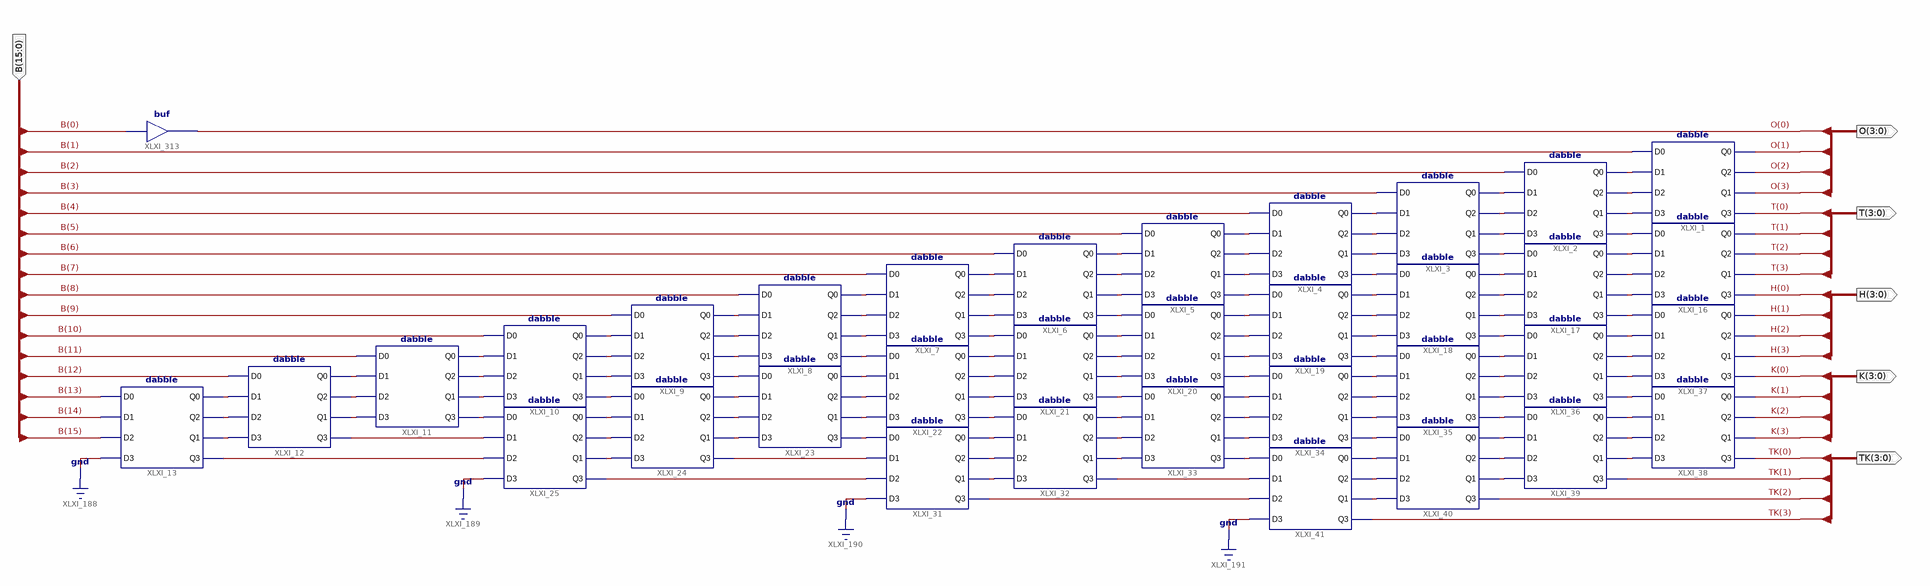
[diagram p0: schematic sheet 1]
// Xilinx ISE schematic dd16b.sch (spartan6) as structural Verilog: 35 symbols, 6 ports
module dd16b (
  input  [15:0] B,
  output [3:0] O,
  output [3:0] T,
  output [3:0] H,
  output [3:0] K,
  output [3:0] TK
);

  wire XLXN_4, XLXN_5, XLXN_6, XLXN_7, XLXN_8, XLXN_9, XLXN_10, XLXN_11, XLXN_12, XLXN_13, XLXN_14, XLXN_15,
       XLXN_16, XLXN_17, XLXN_18, XLXN_24, XLXN_25, XLXN_26, XLXN_27, XLXN_28, XLXN_29, XLXN_30, XLXN_31,
       XLXN_32, XLXN_33, XLXN_34, XLXN_35, XLXN_36, XLXN_37, XLXN_38, XLXN_39, XLXN_40, XLXN_41, XLXN_42,
       XLXN_43, XLXN_44, XLXN_45, XLXN_46, XLXN_47, XLXN_48, XLXN_49, XLXN_50, XLXN_51, XLXN_52, XLXN_53,
       XLXN_54, XLXN_55, XLXN_56, XLXN_57, XLXN_58, XLXN_59, XLXN_60, XLXN_61, XLXN_62, XLXN_63, XLXN_64,
       XLXN_65, XLXN_69, XLXN_70, XLXN_71, XLXN_72, XLXN_73, XLXN_74, XLXN_75, XLXN_76, XLXN_77, XLXN_78,
       XLXN_79, XLXN_80, XLXN_81, XLXN_82, XLXN_83, XLXN_84, XLXN_85, XLXN_86, XLXN_87, XLXN_88, XLXN_89,
       XLXN_90, XLXN_91, XLXN_92, XLXN_93, XLXN_94, XLXN_95, XLXN_96, XLXN_97, XLXN_98, XLXN_99, XLXN_103,
       XLXN_104, XLXN_105, XLXN_106, XLXN_107, XLXN_108, XLXN_109, XLXN_110, XLXN_111, XLXN_112, XLXN_113,
       XLXN_114, XLXN_115, XLXN_116, XLXN_117, XLXN_118, XLXN_119, XLXN_120, XLXN_121, XLXN_125, XLXN_126,
       XLXN_127, XLXN_128, XLXN_129, XLXN_130, XLXN_131, XLXN_135, XLXN_137, XLXN_139;

  dabble XLXI_1 (.D0(B[1]), .D1(XLXN_4), .D2(XLXN_5), .D3(XLXN_6), .Q0(O[1]), .Q1(O[3]), .Q2(O[2]), .Q3(T[0]));
  dabble XLXI_2 (
    .D0(B[2]), .D1(XLXN_38), .D2(XLXN_37), .D3(XLXN_36), .Q0(XLXN_4), .Q1(XLXN_6), .Q2(XLXN_5), .Q3(XLXN_7));
  dabble XLXI_3 (
    .D0(B[3]), .D1(XLXN_39), .D2(XLXN_40), .D3(XLXN_41), .Q0(XLXN_38), .Q1(XLXN_36), .Q2(XLXN_37),
    .Q3(XLXN_35));
  dabble XLXI_4 (
    .D0(B[4]), .D1(XLXN_48), .D2(XLXN_55), .D3(XLXN_56), .Q0(XLXN_39), .Q1(XLXN_41), .Q2(XLXN_40),
    .Q3(XLXN_42));
  dabble XLXI_5 (
    .D0(B[5]), .D1(XLXN_69), .D2(XLXN_70), .D3(XLXN_71), .Q0(XLXN_48), .Q1(XLXN_56), .Q2(XLXN_55),
    .Q3(XLXN_57));
  dabble XLXI_6 (
    .D0(B[6]), .D1(XLXN_81), .D2(XLXN_82), .D3(XLXN_83), .Q0(XLXN_69), .Q1(XLXN_71), .Q2(XLXN_70),
    .Q3(XLXN_72));
  dabble XLXI_7 (
    .D0(B[7]), .D1(XLXN_92), .D2(XLXN_93), .D3(XLXN_94), .Q0(XLXN_81), .Q1(XLXN_83), .Q2(XLXN_82),
    .Q3(XLXN_84));
  dabble XLXI_8 (
    .D0(B[8]), .D1(XLXN_103), .D2(XLXN_104), .D3(XLXN_105), .Q0(XLXN_92), .Q1(XLXN_94), .Q2(XLXN_93),
    .Q3(XLXN_95));
  dabble XLXI_9 (
    .D0(B[9]), .D1(XLXN_111), .D2(XLXN_112), .D3(XLXN_113), .Q0(XLXN_103), .Q1(XLXN_105), .Q2(XLXN_104),
    .Q3(XLXN_106));
  dabble XLXI_10 (
    .D0(B[10]), .D1(XLXN_118), .D2(XLXN_119), .D3(XLXN_120), .Q0(XLXN_111), .Q1(XLXN_113), .Q2(XLXN_112),
    .Q3(XLXN_114));
  dabble XLXI_11 (
    .D0(B[11]), .D1(XLXN_125), .D2(XLXN_126), .D3(XLXN_127), .Q0(XLXN_118), .Q1(XLXN_120), .Q2(XLXN_119),
    .Q3(XLXN_121));
  dabble XLXI_12 (
    .D0(B[12]), .D1(XLXN_129), .D2(XLXN_130), .D3(XLXN_131), .Q0(XLXN_125), .Q1(XLXN_127), .Q2(XLXN_126),
    .Q3(XLXN_128));
  dabble XLXI_13 (
    .D0(B[13]), .D1(B[14]), .D2(B[15]), .D3(1'b0), .Q0(XLXN_129), .Q1(XLXN_131), .Q2(XLXN_130), .Q3(XLXN_135));
  dabble XLXI_16 (.D0(XLXN_7), .D1(XLXN_8), .D2(XLXN_9), .D3(XLXN_10), .Q0(T[1]), .Q1(T[3]), .Q2(T[2]), .Q3(H[0]));
  dabble XLXI_17 (
    .D0(XLXN_35), .D1(XLXN_34), .D2(XLXN_33), .D3(XLXN_32), .Q0(XLXN_8), .Q1(XLXN_10), .Q2(XLXN_9),
    .Q3(XLXN_11));
  dabble XLXI_18 (
    .D0(XLXN_42), .D1(XLXN_43), .D2(XLXN_44), .D3(XLXN_45), .Q0(XLXN_34), .Q1(XLXN_32), .Q2(XLXN_33),
    .Q3(XLXN_31));
  dabble XLXI_19 (
    .D0(XLXN_57), .D1(XLXN_58), .D2(XLXN_59), .D3(XLXN_60), .Q0(XLXN_43), .Q1(XLXN_45), .Q2(XLXN_44),
    .Q3(XLXN_46));
  dabble XLXI_20 (
    .D0(XLXN_72), .D1(XLXN_73), .D2(XLXN_74), .D3(XLXN_75), .Q0(XLXN_58), .Q1(XLXN_60), .Q2(XLXN_59),
    .Q3(XLXN_61));
  dabble XLXI_21 (
    .D0(XLXN_84), .D1(XLXN_85), .D2(XLXN_86), .D3(XLXN_87), .Q0(XLXN_73), .Q1(XLXN_75), .Q2(XLXN_74),
    .Q3(XLXN_76));
  dabble XLXI_22 (
    .D0(XLXN_95), .D1(XLXN_96), .D2(XLXN_97), .D3(XLXN_98), .Q0(XLXN_85), .Q1(XLXN_87), .Q2(XLXN_86),
    .Q3(XLXN_88));
  dabble XLXI_23 (
    .D0(XLXN_106), .D1(XLXN_107), .D2(XLXN_108), .D3(XLXN_109), .Q0(XLXN_96), .Q1(XLXN_98), .Q2(XLXN_97),
    .Q3(XLXN_99));
  dabble XLXI_24 (
    .D0(XLXN_114), .D1(XLXN_115), .D2(XLXN_116), .D3(XLXN_117), .Q0(XLXN_107), .Q1(XLXN_109), .Q2(XLXN_108),
    .Q3(XLXN_110));
  dabble XLXI_25 (
    .D0(XLXN_121), .D1(XLXN_128), .D2(XLXN_135), .D3(1'b0), .Q0(XLXN_115), .Q1(XLXN_117), .Q2(XLXN_116),
    .Q3(XLXN_137));
  dabble XLXI_31 (
    .D0(XLXN_99), .D1(XLXN_110), .D2(XLXN_137), .D3(1'b0), .Q0(XLXN_89), .Q1(XLXN_91), .Q2(XLXN_90),
    .Q3(XLXN_139));
  dabble XLXI_32 (
    .D0(XLXN_88), .D1(XLXN_89), .D2(XLXN_90), .D3(XLXN_91), .Q0(XLXN_77), .Q1(XLXN_79), .Q2(XLXN_78),
    .Q3(XLXN_80));
  dabble XLXI_33 (
    .D0(XLXN_76), .D1(XLXN_77), .D2(XLXN_78), .D3(XLXN_79), .Q0(XLXN_62), .Q1(XLXN_64), .Q2(XLXN_63),
    .Q3(XLXN_65));
  dabble XLXI_34 (
    .D0(XLXN_61), .D1(XLXN_62), .D2(XLXN_63), .D3(XLXN_64), .Q0(XLXN_47), .Q1(XLXN_50), .Q2(XLXN_49),
    .Q3(XLXN_51));
  dabble XLXI_35 (
    .D0(XLXN_46), .D1(XLXN_47), .D2(XLXN_49), .D3(XLXN_50), .Q0(XLXN_30), .Q1(XLXN_28), .Q2(XLXN_29),
    .Q3(XLXN_27));
  dabble XLXI_36 (
    .D0(XLXN_31), .D1(XLXN_30), .D2(XLXN_29), .D3(XLXN_28), .Q0(XLXN_12), .Q1(XLXN_14), .Q2(XLXN_13),
    .Q3(XLXN_15));
  dabble XLXI_37 (.D0(XLXN_11), .D1(XLXN_12), .D2(XLXN_13), .D3(XLXN_14), .Q0(H[1]), .Q1(H[3]), .Q2(H[2]), .Q3(K[0]));
  dabble XLXI_38 (.D0(XLXN_15), .D1(XLXN_16), .D2(XLXN_17), .D3(XLXN_18), .Q0(K[1]), .Q1(K[3]), .Q2(K[2]), .Q3(TK[0]));
  dabble XLXI_39 (
    .D0(XLXN_27), .D1(XLXN_26), .D2(XLXN_25), .D3(XLXN_24), .Q0(XLXN_16), .Q1(XLXN_18), .Q2(XLXN_17),
    .Q3(TK[1]));
  dabble XLXI_40 (
    .D0(XLXN_51), .D1(XLXN_52), .D2(XLXN_53), .D3(XLXN_54), .Q0(XLXN_26), .Q1(XLXN_24), .Q2(XLXN_25),
    .Q3(TK[2]));
  dabble XLXI_41 (
    .D0(XLXN_65), .D1(XLXN_80), .D2(XLXN_139), .D3(1'b0), .Q0(XLXN_52), .Q1(XLXN_54), .Q2(XLXN_53), .Q3(TK[3]));
  buf XLXI_313 (O[0], B[0]);
endmodule
